# EAGLE schematic full_schematic (EAGLE 9.6.2)
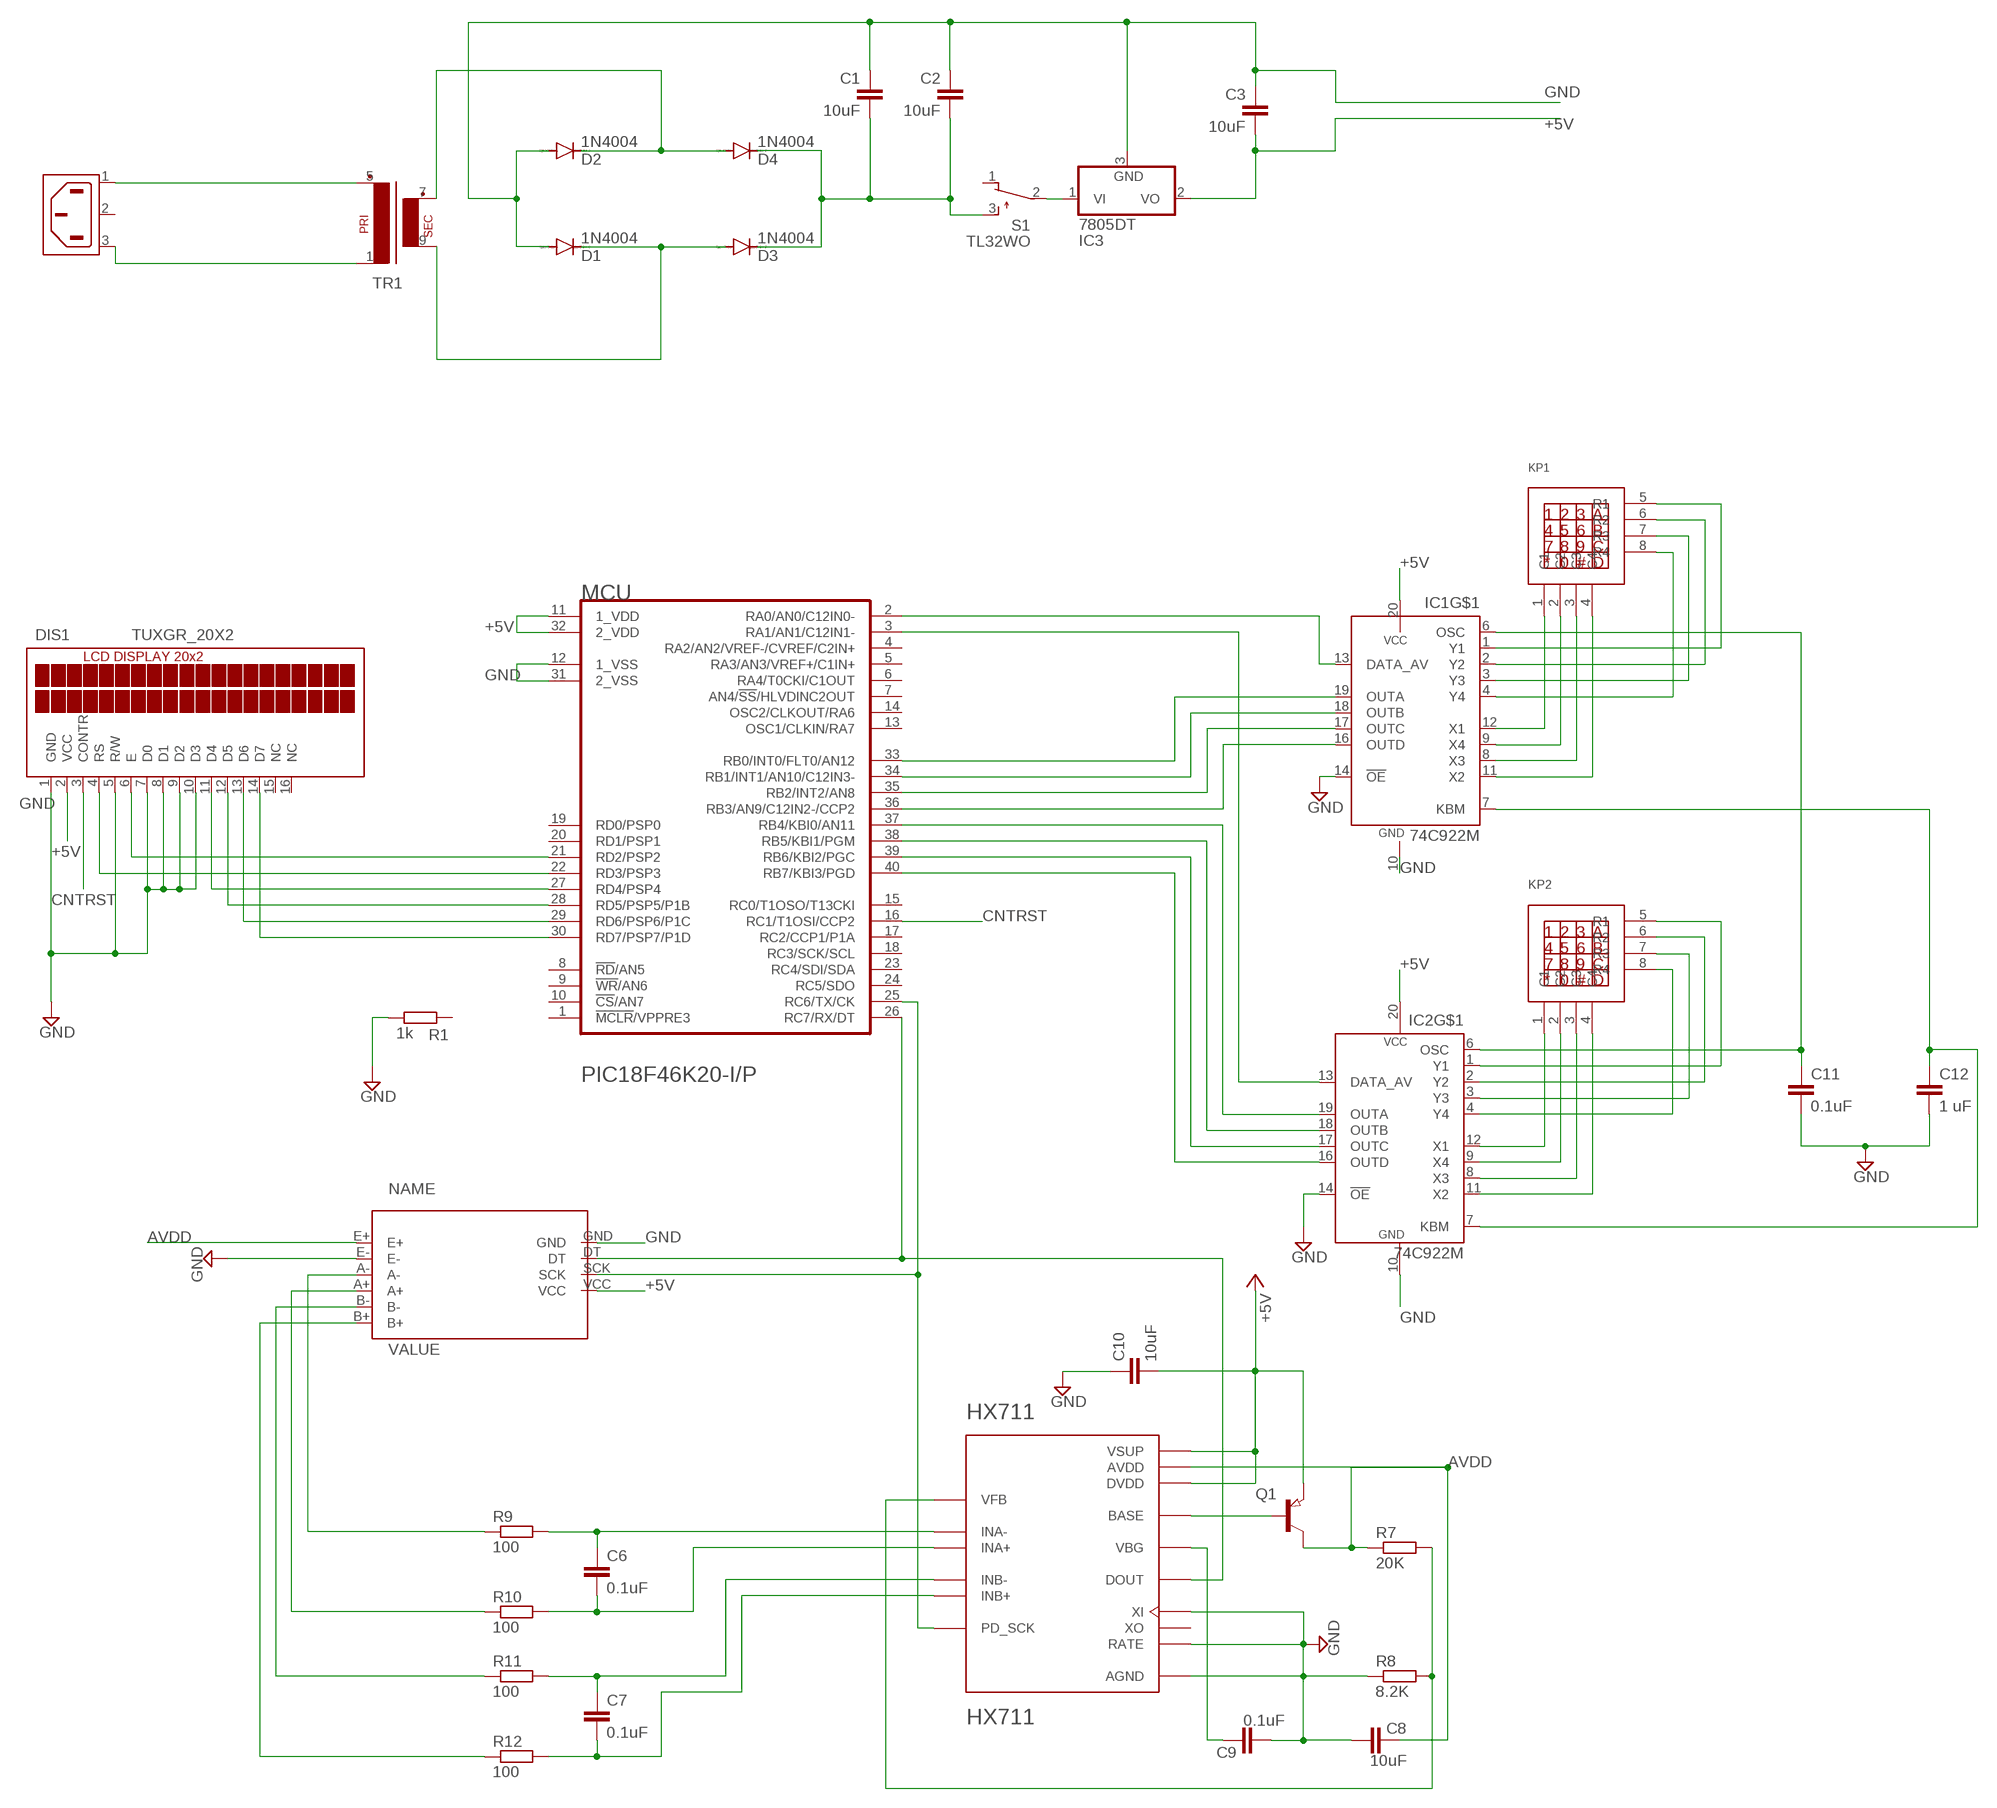
[diagram p0: schematic, sheet 1]

## Parts
C1  10uF  C2.5/2  [C2.5-2]
C2  10uF  C2.5/2  [C2.5-2]
C3  10uF  C2.5/2  [C2.5-2]
C6  0.1uF  C2.5/2  [C2.5-2]
C7  0.1uF  C2.5/2  [C2.5-2]
C8  10uF  C2.5/2  [C2.5-2]
C9  0.1uF  C2.5/2  [C2.5-2]
C10  10uF  C2.5/2  [C2.5-2]
C11  0.1uF  C2.5/2  [C2.5-2]
C12  1 uF  C2.5/2  [C2.5-2]
D1  1N4004  [DO41-10]
D2  1N4004  [DO41-10]
D3  1N4004  [DO41-10]
D4  1N4004  [DO41-10]
DIS1  TUXGR_20X2  [TUXGR_20X2]
HX711  HX711  [SOP127P600X180-16N]
HX711MODULE  hx  HX711A  [HX711]
IC1  74C922M  [SO20W]
IC2  74C922M  [SO20W]
IC3  7805DT  [TO252]
KP1  KEYPAD4X4  [KEYPAD4X4]
KP2  KEYPAD4X4  [KEYPAD4X4]
MCU  MICROCHIP_PIC18F46K20-I-PMICROCHIP_PIC18F46K20-I-P_0_0  [MICROCHIP_PIC18F46K20-I-P_0]
Q1  PNP-TRANSISTOR_SOT23  [SOT23]
R1  1k  R-EU_R0603  [R0603]
R7  20K  R-EU_R0603  [R0603]
R8  8.2K  R-EU_R0603  [R0603]
R9  100  R-EU_R0603  [R0603]
R10  100  R-EU_R0603  [R0603]
R11  100  R-EU_R0603  [R0603]
R12  100  R-EU_R0603  [R0603]
S1  TL32WO  [TL3XWO]
TR1  EI30-1  [EI30-1]
X1  6ESRM-P  [6ESRM-P]

## Nets
+5V: C3.2 C10.2 DIS1.2(VCC) HX711.1(VSUP) HX711.16(DVDD) HX711MODULE.VCC IC1.20(P:VCC) IC2.20(P:VCC) IC3.2(VO) MCU.11(1_VDD) MCU.32(2_VDD) Q1.2(E)
AVDD: C8.1 HX711.3(AVDD) HX711MODULE.E+ Q1.3(C) R7.1
CNTRST: DIS1.3(CONTR) MCU.16(RC1/T1OSI/CCP2)
GND: C1.1 C2.1 C3.1 C8.2 C9.2 C10.1 C11.2 C12.2 D1.A D2.A DIS1.1(GND) DIS1.5(R/W) DIS1.7(D0) DIS1.8(D1) DIS1.9(D2) DIS1.10(D3) HX711.5(AGND) HX711.14(XI) HX711.15(RATE) HX711MODULE.E- HX711MODULE.GND IC1.10(P:GND) IC1.14(!OE) IC2.10(P:GND) IC2.14(!OE) IC3.3(GND) MCU.12(1_VSS) MCU.31(2_VSS) R1.1 R8.1
N$1: HX711.2(BASE) Q1.1(B)
N$3: HX711.4(VFB) R7.2 R8.2
N$4: C6.1 HX711.7(INA-) R9.2
N$5: C6.2 HX711.8(INA+) R10.2
N$6: C7.1 HX711.9(INB-) R11.2
N$7: C7.2 HX711.10(INB+) R12.2
N$8: C9.1 HX711.6(VBG)
N$9: HX711MODULE.A+ R10.1
N$10: HX711MODULE.A- R9.1
N$11: IC1.16(OUTD) MCU.36(RB3/AN9/C12IN2-/CCP2)
N$12: HX711MODULE.B- R11.1
N$14: HX711.12(DOUT) HX711MODULE.DT MCU.26(RC7/RX/DT)
N$15: HX711.11(PD_SCK) HX711MODULE.SCK MCU.25(RC6/TX/CK)
N$16: IC1.17(OUTC) MCU.35(RB2/INT2/AN8)
N$17: IC1.18(OUTB) MCU.34(RB1/INT1/AN10/C12IN3-)
N$18: IC1.19(OUTA) MCU.33(RB0/INT0/FLT0/AN12)
N$19: IC2.19(OUTA) MCU.37(RB4/KBI0/AN11)
N$20: IC2.18(OUTB) MCU.38(RB5/KBI1/PGM)
N$21: IC2.17(OUTC) MCU.39(RB6/KBI2/PGC)
N$22: IC2.16(OUTD) MCU.40(RB7/KBI3/PGD)
N$23: IC1.12(X1) KP1.1(C1)
N$24: IC1.9(X4) KP1.2(C2)
N$25: IC1.8(X3) KP1.3(C3)
N$26: IC1.11(X2) KP1.4(C4)
N$27: IC1.1(Y1) KP1.5(R1)
N$28: IC1.2(Y2) KP1.6(R2)
N$29: IC1.3(Y3) KP1.7(R3)
N$30: IC1.4(Y4) KP1.8(R4)
N$31: IC2.12(X1) KP2.1(C1)
N$32: IC2.9(X4) KP2.2(C2)
N$33: IC2.8(X3) KP2.3(C3)
N$34: IC2.11(X2) KP2.4(C4)
N$35: IC2.4(Y4) KP2.8(R4)
N$36: IC2.3(Y3) KP2.7(R3)
N$37: IC2.2(Y2) KP2.6(R2)
N$38: IC2.1(Y1) KP2.5(R1)
N$39: DIS1.6(E) MCU.21(RD2/PSP2)
N$40: DIS1.11(D4) MCU.27(RD4/PSP4)
N$41: DIS1.12(D5) MCU.28(RD5/PSP5/P1B)
N$42: DIS1.13(D6) MCU.29(RD6/PSP6/P1C)
N$43: DIS1.14(D7) MCU.30(RD7/PSP7/P1D)
N$44: DIS1.4(RS) MCU.22(RD3/PSP3)
N$45: IC1.13(DATA_AV) MCU.2(RA0/AN0/C12IN0-)
N$46: C12.1 IC1.7(KBM) IC2.7(KBM)
N$47: D1.C D3.A TR1.9(S4)
N$48: D2.C D4.A TR1.7(S3)
N$49: TR1.1 X1.3(AC2)
N$50: TR1.5(P2) X1.1(AC1)
N$51: HX711MODULE.B+ R12.1
N$52: C1.2 C2.2 D3.C D4.C S1.3(S)
N$58: C11.1 IC1.6(OSC) IC2.6(OSC)
N$59: IC3.1(VI) S1.2(P)
N$60: IC2.13(DATA_AV) MCU.3(RA1/AN1/C12IN1-)
Unconnected: DIS1.15(NC) DIS1.16(NC) HX711.13(XO) MCU.1(!MCLR!/VPPRE3) MCU.4(RA2/AN2/VREF-/CVREF/C2IN+) MCU.5(RA3/AN3/VREF+/C1IN+) MCU.6(RA4/T0CKI/C1OUT) MCU.7(AN4/!SS!/HLVDINC2OUT) MCU.8(!RD!/AN5) MCU.9(!WR!/AN6) MCU.10(!CS!/AN7) MCU.13(OSC1/CLKIN/RA7) MCU.14(OSC2/CLKOUT/RA6) MCU.15(RC0/T1OSO/T13CKI) MCU.17(RC2/CCP1/P1A) MCU.18(RC3/SCK/SCL) MCU.19(RD0/PSP0) MCU.20(RD1/PSP1) MCU.23(RC4/SDI/SDA) MCU.24(RC5/SDO) R1.2 S1.1(O) X1.2(SH)

## Library data of the parts
C1-C3 C6-C12 = capacitor-wima:C: CAPACITOR naming: grid - package width
D1-D4 = diode:1N4004: DIODE general purpose rectifier, 1 A
DIS1 = display-lcd:TUXGR_20X2: Tuxgraphics LCD display 20x2 characters reflective, without background light Source: tuxgr_20x2.pdf; OC_FARNELL: unknown; OC_NEWARK: unknown
HX711 = HX711ss:HX711: Check availability <https://pricing.snapeda.com/parts/HX711/AVIA%20SEMICONDUCTOR/view-part?ref=eda>; AVAILABILITY: Not in stock; DESCRIPTION: Precision 24-bit analog-to-digital converter (ADC) designed for weigh scales and industrial control applications to interface directly with a bridge sensor.; MF: AVIA SEMICONDUCTOR; MP: HX711; PACKAGE: None; PRICE: None
HX711MODULE = HX711:HX711
IC1 IC2 = 74xx-eu_ff:74C922: 16-Key Encoder Source: http://www.national.com/ds/MM/MM54C922.pdf#page=1
IC3 = linear:78*: Positive VOLTAGE REGULATOR Source: http://cache.national.com/ds/LM/LM78L05.pdf http://www.fairchildsemi.com/ds/LM/LM7805.pdf
KP1 KP2 = keypad_4x4_raw:KEYPAD4X4
MCU = P:MICROCHIP_PIC18F46K20-I-P: MC-8B-18F45K20-IL40; CIIVA_IDS: 1156701; DATASHEET_VERSION: revF, Sep-2009; FOOTPRINT_VARIANT_NAME_0: Manufacturer Recommended; IMPORTED: yes; IMPORTED_FROM: vault; IMPORT_TS: 1521846864; MF: Microchip; MPN: PIC18F46K20-I/P; PACKAGE: PDIP600-P40; PACKAGE_DESCRIPTION: 40-Lead Plastic Dual In-Line (P) - 600 mil Body [PDIP]; PACKAGE_VERSION: revBB, Aug-2009; PREFIX: U; RELEASE_DATE: 1300262623; VAULT_GUID: 62ADF5D1-6D2B-4FDE-90F0-0F8BF26695C1; VAULT_REVISION: 3C46FF8B-A334-4966-A067-8205D2A13521
Q1 = semicon-smd-ipc:PNP-TRANSISTOR_: PNP TRANSISTOR
R1 R7-R12 = rcl:R-EU_: RESISTOR, European symbol; SPICEPREFIX: R
S1 = switch:TL32WO: TINY SWITCH ON - MOM Source: http://www2.produktinfo.conrad.com/datenblaetter/700000-724999/705152-da-01-de-Subminiaturschalter_TL_36WO.pdf
TR1 = trafo:EI30-1: TRANSFORMER 1 primary winding, 1 secondary winding ERA
X1 = con-tycoelectronics:6ESRM-P: AC Connector 120/250 VAC Source: http://catalog.tycoelectronics.com .. ENG_DS_1654001_1099_SR_0406.pdf; MF: TYCO ELECTRONICS; MPN: 6ESRM-P; OC_FARNELL: unknown; OC_NEWARK: 87F1821